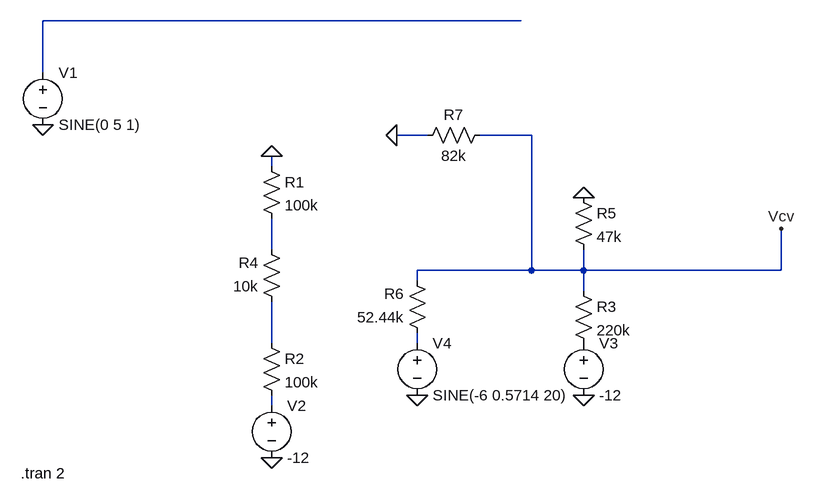
[diagram p0: schematic ScreamFilter CV.asc]
ScreamFilter CV.asc, the LTspice schematic file:
Version 4
SHEET 1 880 680
WIRE 432 -144 -304 -144
WIRE -304 -64 -304 -144
WIRE 288 32 240 32
WIRE 448 32 368 32
WIRE 48 80 48 64
WIRE 48 208 48 160
WIRE 448 240 448 32
WIRE 448 240 272 240
WIRE 528 240 528 208
WIRE 528 240 448 240
WIRE 832 240 832 176
WIRE 832 240 528 240
WIRE 272 256 272 240
WIRE 528 272 528 240
WIRE 48 352 48 288
WIRE 272 352 272 336
WIRE 48 448 48 432
FLAG 48 64 0
FLAG 48 528 0
FLAG -304 16 0
FLAG 528 128 0
FLAG 528 432 0
FLAG 272 432 0
FLAG 240 32 0
FLAG 832 176 Vcv
SYMBOL res 32 64 R0
SYMATTR InstName R1
SYMATTR Value 100k
SYMBOL res 32 336 R0
SYMATTR InstName R2
SYMATTR Value 100k
SYMBOL res 64 304 R180
WINDOW 0 36 76 Left 2
WINDOW 3 36 40 Left 2
SYMATTR InstName R4
SYMATTR Value 10k
SYMBOL voltage 48 432 R0
WINDOW 123 0 0 Left 2
WINDOW 39 0 0 Left 2
SYMATTR InstName V2
SYMATTR Value -12
SYMBOL res 512 256 R0
SYMATTR InstName R3
SYMATTR Value 220k
SYMBOL voltage -304 -80 R0
WINDOW 123 0 0 Left 2
WINDOW 39 0 0 Left 2
SYMATTR InstName V1
SYMATTR Value SINE(0 5 1)
SYMBOL res 512 112 R0
SYMATTR InstName R5
SYMATTR Value 47k
SYMBOL voltage 528 336 R0
WINDOW 123 0 0 Left 2
WINDOW 39 0 0 Left 2
SYMATTR InstName V3
SYMATTR Value -12
SYMBOL voltage 272 336 R0
WINDOW 123 0 0 Left 2
WINDOW 39 0 0 Left 2
SYMATTR InstName V4
SYMATTR Value SINE(-6 0.5714 20)
SYMBOL res 288 352 R180
WINDOW 0 36 76 Left 2
WINDOW 3 36 40 Left 2
SYMATTR InstName R6
SYMATTR Value 52.44k
SYMBOL res 272 48 R270
WINDOW 0 32 56 VTop 2
WINDOW 3 0 56 VBottom 2
SYMATTR InstName R7
SYMATTR Value 82k
TEXT -338 552 Left 2 !.tran 2

The netlist it stands for:
* ScreamFilter CV.asc
R1 0 N002 100k
R2 N003 N005 100k
R4 N003 N002 10k
V2 N005 0 -12
R3 Vcv P001 220k
V1 N001 0 SINE(0 5 1)
R5 0 Vcv 47k
V3 P001 0 -12
V4 N004 0 SINE(-6 0.5714 20)
R6 N004 Vcv 52.44k
R7 0 Vcv 82k
.tran 2
.backanno
.end